# EAGLE design gameboy (EAGLE 6.6.0)
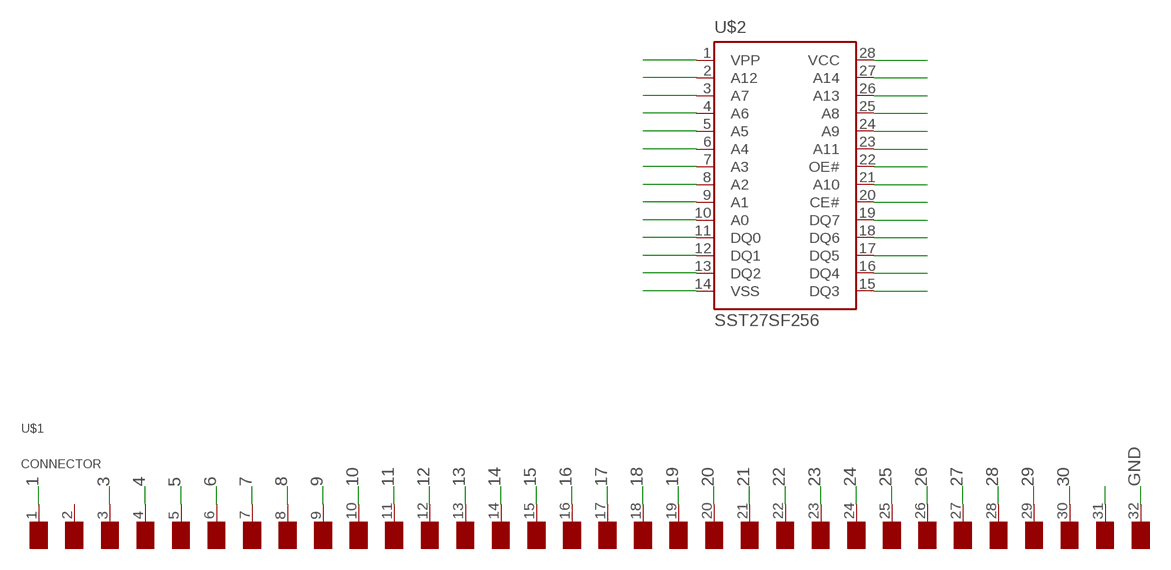
[diagram p0: schematic, sheet 1]

## Parts
U$1  CONNECTOR  [CONNECTOR]
U$2  SST27SF256  [DIL28-6]

## Nets
1: U$1.1(VDD) U$2.28(VCC)
3: U$1.3(/WR)
4: U$1.4(/RD) U$2.22(OE#)
5: U$1.5(/RCS)
6: U$1.6(A0) U$2.10(A0)
7: U$1.7(A1) U$2.9(A1)
8: U$1.8(A2) U$2.8(A2)
9: U$1.9(A3) U$2.7(A3)
10: U$1.10(A4) U$2.6(A4)
11: U$1.11(A5) U$2.5(A5)
12: U$1.12(A6) U$2.4(A6)
13: U$1.13(A7) U$2.3(A7)
14: U$1.14(A8) U$2.25(A8)
15: U$1.15(A9) U$2.24(A9)
16: U$1.16(A10) U$2.21(A10)
17: U$1.17(A11) U$2.23(A11)
18: U$1.18(A12) U$2.2(A12)
19: U$1.19(A13) U$2.26(A13)
20: U$1.20(A14) U$2.27(A14)
21: U$1.21(A15) U$2.20(CE#)
22: U$1.22(D0) U$2.11(DQ0)
23: U$1.23(D1) U$2.12(DQ1)
24: U$1.24(D2) U$2.13(DQ2)
25: U$1.25(D3) U$2.15(DQ3)
26: U$1.26(D4) U$2.16(DQ4)
27: U$1.27(D5) U$2.17(DQ5)
28: U$1.28(D6) U$2.18(DQ6)
29: U$1.29(D7) U$2.19(DQ7)
30: U$1.30(/RS)
31: U$1.31(VIN)
GND: U$1.32(GND) U$2.14(VSS)
N$1: U$2.1(VPP)
Unconnected: U$1.2(NC)

## Library data of the parts
U$1 = gameboy:CONNECTOR: Connector Pads for Gameboy Cartridges
U$2 = sst:SST27SF256

## Board
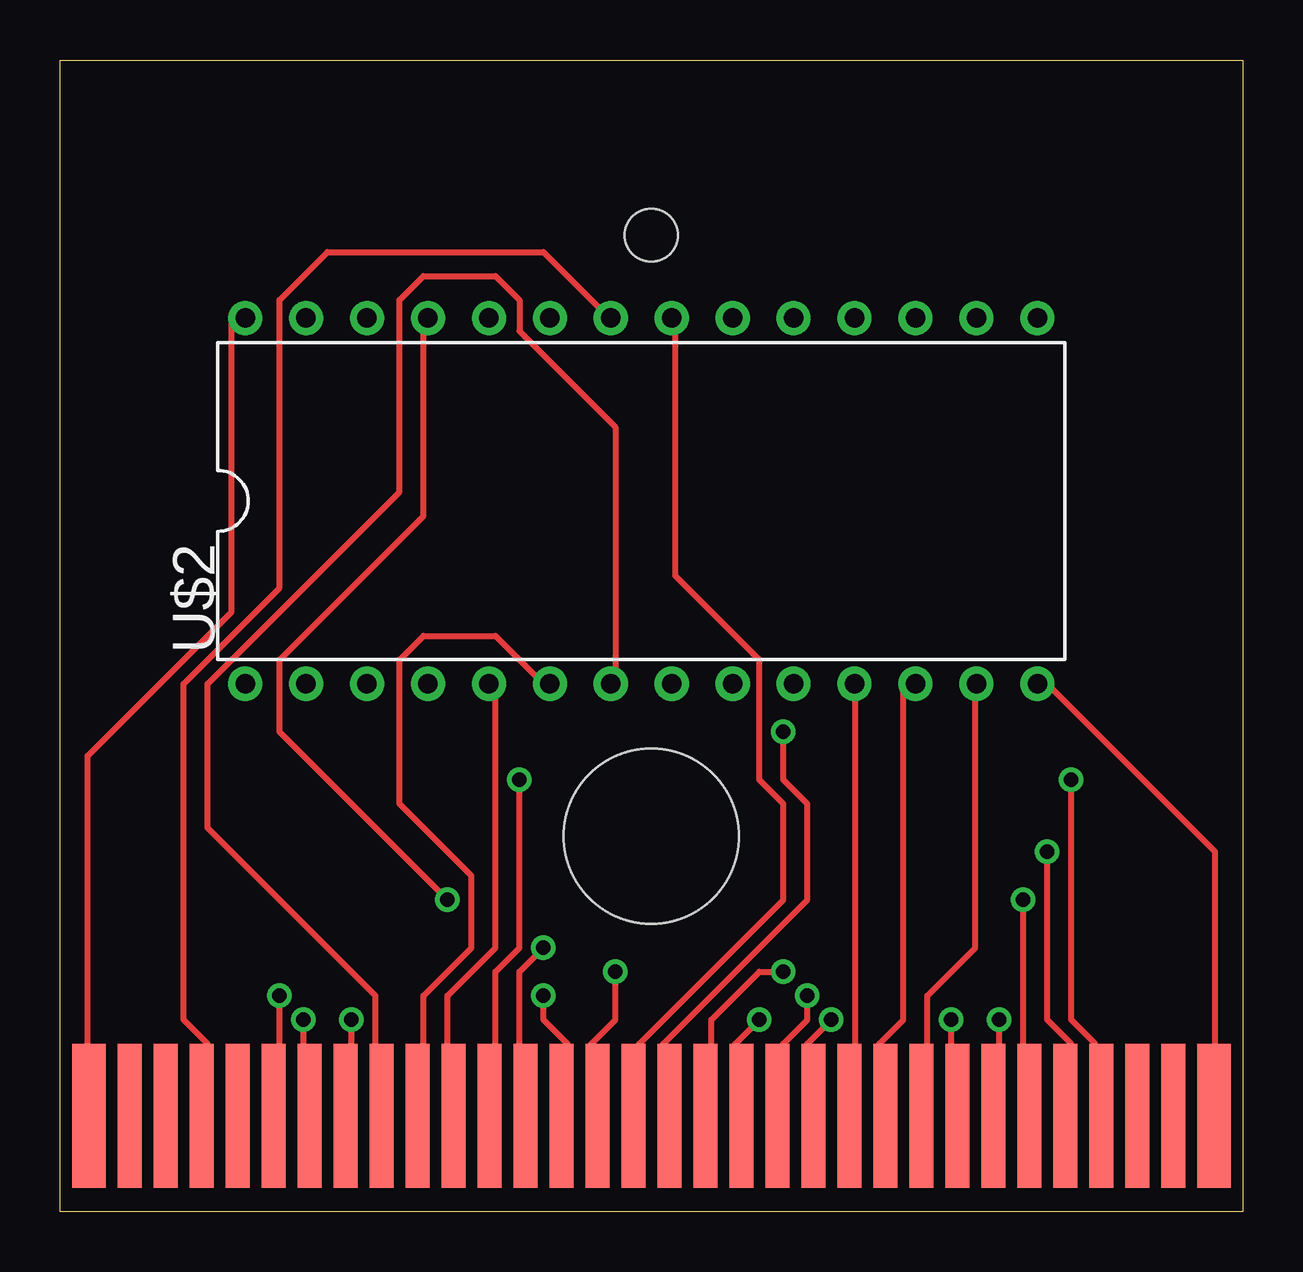
[diagram p1: board, top side]
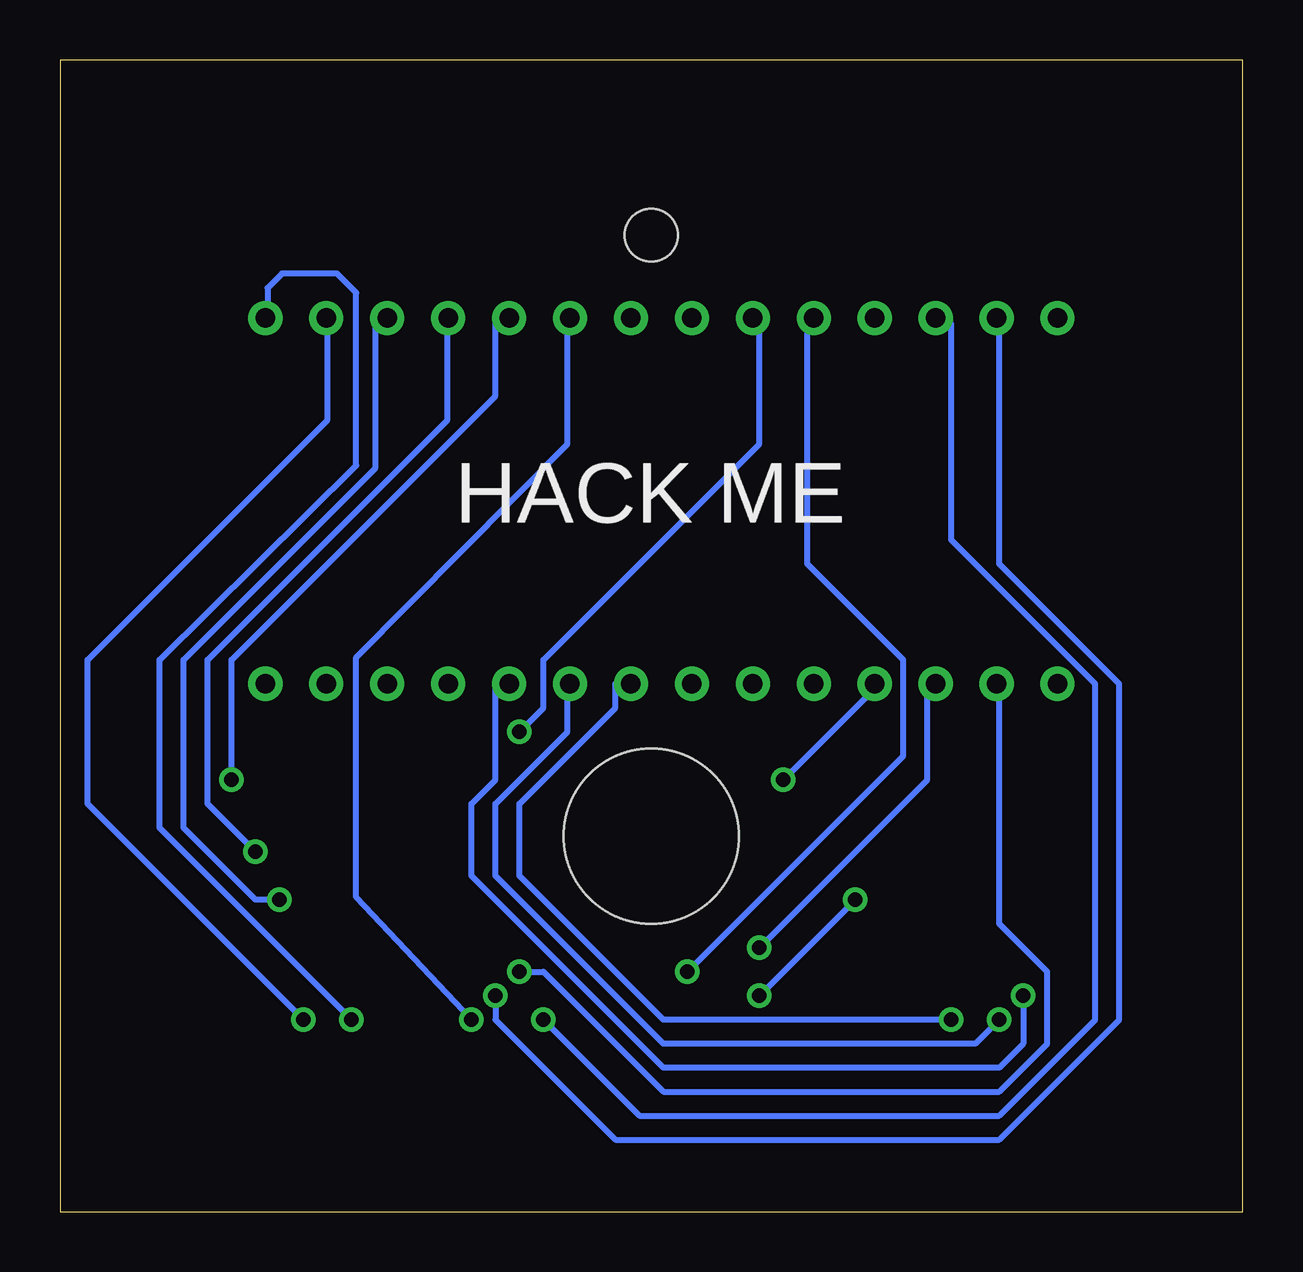
[diagram p2: board, bottom side, seen from below]

Size 49.3 x 48 mm. Coordinates in mm from the lower left corner, seen from the top.
Outline: 0,48 49.3,48 49.3,0 0,0 0,48
Copper layers (1*16): Top 0.035mm / dielectric 1.5mm / Bottom 0.035mm
Design rules "default": minimum track width 10mil, minimum drill 24mil, track to track 8mil, track to pad 8mil, pad to pad 8mil, via to via 8mil, smd to smd 8mil, copper to edge 40mil, drill to drill 8mil, minimum pad ring 10mil, minimum via ring 8mil, stop-mask expansion 4mil, vias tented up to drill 0mil, thermal gap 10mil
Holes 7.3 mm at 24.65,15.65
Holes 2.2 mm at 24.65,40.7

### Footprints (pad centres in the part's own frame; a part is rotated, then mirrored left to right if it is on the bottom)
CONNECTOR = smd 1.4 x 6: 1 0.7,-3; 32 47.6,-3 | smd 1 x 6: 2 2.4,-3; 3 3.9,-3; 4 5.4,-3; 5 6.9,-3; 6 8.4,-3; 7 9.9,-3; 8 11.4,-3; 9 12.9,-3; 10 14.4,-3; 11 15.9,-3; 12 17.4,-3; 13 18.9,-3; 14 20.4,-3; 15 21.9,-3; 16 23.4,-3; 17 24.9,-3; 18 26.4,-3; 19 27.9,-3; 20 29.4,-3; 21 30.9,-3; 22 32.4,-3; 23 33.9,-3; 24 35.4,-3; 25 36.9,-3; 26 38.4,-3; 27 39.9,-3; 28 41.4,-3; 29 42.9,-3; 30 44.4,-3; 31 45.9,-3
DIL28-6 = drill 0.813 pad 1.422: 1 -16.51,-7.62; 2 -13.97,-7.62; 3 -11.43,-7.62; 4 -8.89,-7.62; 5 -6.35,-7.62; 6 -3.81,-7.62; 7 -1.27,-7.62; 8 1.27,-7.62; 9 3.81,-7.62; 10 6.35,-7.62; 11 8.89,-7.62; 12 11.43,-7.62; 13 13.97,-7.62; 14 16.51,-7.62; 15 16.51,7.62; 16 13.97,7.62; 17 11.43,7.62; 18 8.89,7.62; 19 6.35,7.62; 20 3.81,7.62; 21 1.27,7.62; 22 -1.27,7.62; 23 -3.81,7.62; 24 -6.35,7.62; 25 -8.89,7.62; 26 -11.43,7.62; 27 -13.97,7.62; 28 -16.51,7.62

### Placement (x,y rotation side)
U$1  0.5,7 0 top
U$2  24.23,29.62 0 top

### Tracks (layer width: path | path; a pad name or v marks a point on that pad's centre or on a via)
1
  Top 0.254: U$2.28 7.15,37 7.15,25 1.15,19 1.15,4 U$1.1
4
  Top 0.254: U$2.22 23.15,37 20.15,40 11.15,40 9.15,38 9.15,26 5.15,22 5.15,8 6.15,7 6.15,4 U$1.4
6  (via drill 0.61)
  Top 0.254: v9.15,9 9.15,4 U$1.6
  Bottom 0.254: v9.15,9 9.15,7 10.15,6 24.15,6 32.15,14 32.15,17 31.15,18 31.15,22 U$2.10
7  (via drill 0.61)
  Top 0.254: v10.15,8 10.15,4 U$1.7
  Bottom 0.254: v10.15,8 11.15,7 24.15,7 31.15,14 31.15,17 28.15,20 28.15,22 U$2.9
8  (via drill 0.61)
  Top 0.254: v12.15,8 12.15,4 U$1.8
  Bottom 0.254: v12.15,8 24.15,8 30.15,14 30.15,17 26.15,21 26.15,22 U$2.8
9
  Top 0.254: U$2.7 23.15,22 23.15,32.7 19.15,36.7 19.15,38 18.15,39 15.15,39 14.15,38 14.15,30 6.15,22 6.15,16 13.15,9 13.15,4 U$1.9
10
  Top 0.254: U$2.6 20.15,22 18.15,24 15.15,24 14.15,23 14.15,17 17.15,14 17.15,11 15.15,9 15.15,4 U$1.10
11
  Top 0.254: U$2.5 18.15,22 18.15,11 16.15,9 16.15,4 U$1.11
12  (via drill 0.61)
  Top 0.254: v19.15,18 19.15,11 18.15,10 18.15,4 U$1.12
  Bottom 0.254: v19.15,18 15.15,22 U$2.4
13  (via drill 0.61)
  Top 0.254: v20.15,11 19.15,10 19.15,4 U$1.13
  Bottom 0.254: v20.15,11 13.15,18 13.15,22 U$2.3
14  (via drill 0.61)
  Top 0.254: v16.15,13 9.15,20 9.15,23 15.15,29 15.15,37 U$2.25 | v20.15,9 20.15,8 21.15,7 21.15,4 U$1.14
  Bottom 0.254: v20.15,9 v16.15,13
15  (via drill 0.61)
  Top 0.254: v23.15,10 23.15,8 22.15,7 22.15,4 U$1.15
  Bottom 0.254: v23.15,10 14.15,19 14.15,23 18.15,27 18.15,37 U$2.24
16
  Top 0.254: U$2.21 25.65,37.5 25.65,26.5 29.15,23 29.15,18 30.15,17 30.15,13 24.15,7 24.15,4 U$1.16
17  (via drill 0.61)
  Top 0.254: v30.15,20 30.15,18 31.15,17 31.15,13 25.15,7 25.15,4 U$1.17
  Bottom 0.254: v30.15,20 29.15,21 29.15,23 20.15,32 20.15,37 U$2.23
18  (via drill 0.61)
  Top 0.254: v30.15,10 29.15,10 27.15,8 27.15,4 U$1.18
  Bottom 0.254: v30.15,10 29.15,10 24.15,5 10.15,5 8.15,7 8.15,10 10.15,12 10.15,22 U$2.2
19  (via drill 0.61)
  Top 0.254: v29.15,8 28.15,7 28.15,4 U$1.19
  Bottom 0.254: v29.15,8 25.15,4 10.15,4 6.15,8 6.15,22 12.15,28 12.15,37 U$2.26
20  (via drill 0.61)
  Top 0.254: v31.15,9 31.15,8 30.15,7 30.15,4 U$1.20
  Bottom 0.254: v31.15,9 31.15,8 26.15,3 10.15,3 5.15,8 5.15,22 10.15,27 10.15,37 U$2.27
21  (via drill 0.61)
  Top 0.254: v32.15,8 31.15,7 31.15,4 U$1.21
  Bottom 0.254: v32.15,8 36.95,13.1 36.95,23.1 28.15,32 28.15,37 U$2.20
22
  Top 0.254: U$2.11 33.15,22 33.15,4 U$1.22
23
  Top 0.254: U$2.12 35.15,22 35.15,8 34.15,7 34.15,4 U$1.23
24
  Top 0.254: U$2.13 38.15,22 38.15,11 36.15,9 36.15,4 U$1.24
25  (via drill 0.61)
  Top 0.254: v37.15,8 37.15,4 U$1.25
  Bottom 0.254: v37.15,8 45.15,16 45.15,23 36.95,31.1 36.95,38.3 37.75,39.1 40.05,39.1 40.65,38.5 40.65,37.33 U$2.15 40.75,37.2
26  (via drill 0.61)
  Top 0.254: v39.15,8 39.15,4 U$1.26
  Bottom 0.254: v39.15,8 48.15,17 48.15,23 38.15,33 38.15,37 U$2.16
27  (via drill 0.61)
  Top 0.254: v40.15,13 40.15,4 U$1.27
  Bottom 0.254: v40.15,13 41.15,13 44.15,16 44.15,23 36.15,31 36.15,37 U$2.17
28  (via drill 0.61)
  Top 0.254: v41.15,15 41.15,8 42.15,7 42.15,4 U$1.28
  Bottom 0.254: v41.15,15 43.15,17 43.15,23 33.15,33 33.15,37 U$2.18
29  (via drill 0.61)
  Top 0.254: v42.15,18 42.15,8 43.15,7 43.15,4 U$1.29
  Bottom 0.254: v42.15,18 42.15,23 31.15,34 31.15,37 U$2.19
GND
  Top 0.254: U$2.14 41.15,22 48.15,15 48.15,4 U$1.32

### Text on the board
bNames: HACK ME